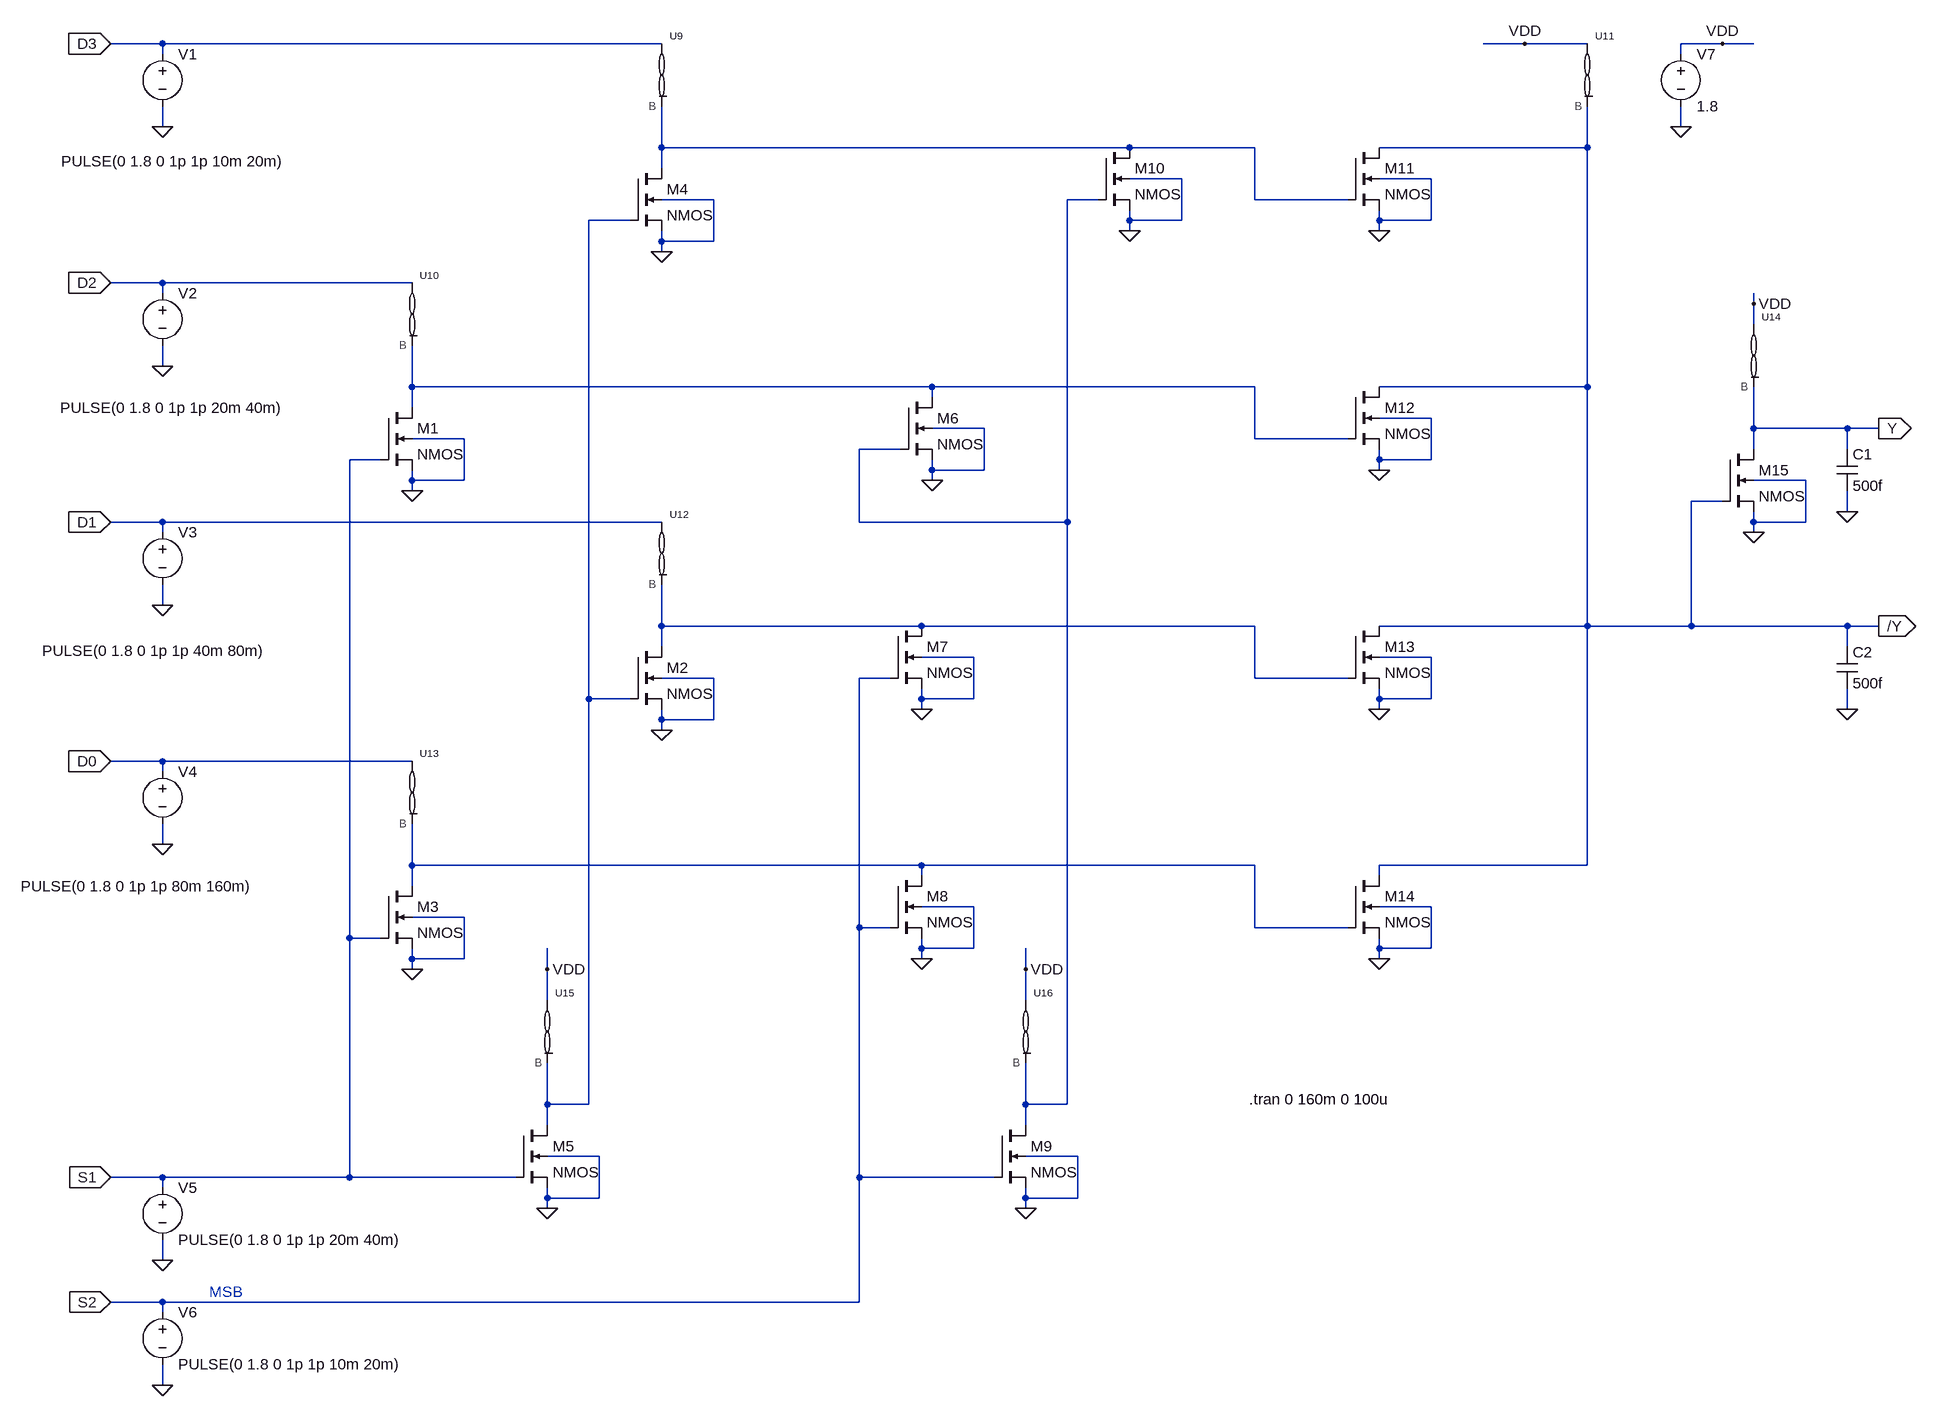
[diagram p0: schematic MUX4to1.asc]
MUX4to1.asc, the LTspice schematic file:
Version 4
SHEET 1 2456 1752
WIRE -272 -352 -352 -352
WIRE 496 -352 -272 -352
WIRE 1824 -352 1760 -352
WIRE 1920 -352 1824 -352
WIRE 2128 -352 2064 -352
WIRE 2176 -352 2128 -352
WIRE -272 -336 -272 -352
WIRE 2064 -336 2064 -352
WIRE -272 -224 -272 -256
WIRE 2064 -224 2064 -256
WIRE 496 -192 496 -256
WIRE 1216 -192 496 -192
WIRE 1408 -192 1216 -192
WIRE 1920 -192 1920 -256
WIRE 1920 -192 1600 -192
WIRE 496 -160 496 -192
WIRE 1296 -144 1216 -144
WIRE 1680 -144 1600 -144
WIRE 576 -112 496 -112
WIRE 1168 -112 1120 -112
WIRE 1408 -112 1408 -192
WIRE 1552 -112 1408 -112
WIRE 448 -80 384 -80
WIRE 1216 -80 1216 -96
WIRE 1296 -80 1296 -144
WIRE 1296 -80 1216 -80
WIRE 1600 -80 1600 -96
WIRE 1680 -80 1680 -144
WIRE 1680 -80 1600 -80
WIRE 1216 -64 1216 -80
WIRE 1600 -64 1600 -80
WIRE 496 -48 496 -64
WIRE 576 -48 576 -112
WIRE 576 -48 496 -48
WIRE 496 -32 496 -48
WIRE -272 16 -352 16
WIRE 112 16 -272 16
WIRE -272 32 -272 16
WIRE 2176 48 2176 32
WIRE 2176 80 2176 48
WIRE -272 144 -272 112
WIRE 112 176 112 112
WIRE 912 176 112 176
WIRE 1408 176 912 176
WIRE 1920 176 1920 -192
WIRE 1920 176 1600 176
WIRE 912 192 912 176
WIRE 112 208 112 176
WIRE 1680 224 1600 224
WIRE 992 240 912 240
WIRE 2176 240 2176 176
WIRE 2320 240 2176 240
WIRE 2368 240 2320 240
WIRE 192 256 112 256
WIRE 1408 256 1408 176
WIRE 1552 256 1408 256
WIRE 864 272 800 272
WIRE 2176 272 2176 240
WIRE 2320 272 2320 240
WIRE 64 288 16 288
WIRE 1600 288 1600 272
WIRE 1680 288 1680 224
WIRE 1680 288 1600 288
WIRE 912 304 912 288
WIRE 992 304 992 240
WIRE 992 304 912 304
WIRE 1600 304 1600 288
WIRE 112 320 112 304
WIRE 192 320 192 256
WIRE 192 320 112 320
WIRE 912 320 912 304
WIRE 2256 320 2176 320
WIRE 112 336 112 320
WIRE 2128 352 2080 352
WIRE 2320 368 2320 336
WIRE -272 384 -352 384
WIRE 496 384 -272 384
WIRE 800 384 800 272
WIRE 1120 384 1120 -112
WIRE 1120 384 800 384
WIRE 2176 384 2176 368
WIRE 2256 384 2256 320
WIRE 2256 384 2176 384
WIRE -272 400 -272 384
WIRE 2176 400 2176 384
WIRE -272 512 -272 480
WIRE 496 544 496 480
WIRE 896 544 496 544
WIRE 1408 544 896 544
WIRE 1920 544 1920 176
WIRE 1920 544 1600 544
WIRE 2080 544 2080 352
WIRE 2080 544 1920 544
WIRE 2320 544 2080 544
WIRE 2368 544 2320 544
WIRE 496 576 496 544
WIRE 2320 576 2320 544
WIRE 976 592 896 592
WIRE 1680 592 1600 592
WIRE 576 624 496 624
WIRE 848 624 800 624
WIRE 1408 624 1408 544
WIRE 1552 624 1408 624
WIRE 384 656 384 -80
WIRE 448 656 384 656
WIRE 896 656 896 640
WIRE 976 656 976 592
WIRE 976 656 896 656
WIRE 1600 656 1600 640
WIRE 1680 656 1680 592
WIRE 1680 656 1600 656
WIRE 896 672 896 656
WIRE 1600 672 1600 656
WIRE 2320 672 2320 640
WIRE 496 688 496 672
WIRE 576 688 576 624
WIRE 576 688 496 688
WIRE 496 704 496 688
WIRE -272 752 -352 752
WIRE 112 752 -272 752
WIRE -272 768 -272 752
WIRE -272 880 -272 848
WIRE 112 912 112 848
WIRE 896 912 112 912
WIRE 1408 912 896 912
WIRE 1920 912 1920 544
WIRE 1920 912 1600 912
WIRE 896 928 896 912
WIRE 1600 928 1600 912
WIRE 112 944 112 912
WIRE 976 976 896 976
WIRE 1680 976 1600 976
WIRE 192 992 112 992
WIRE 800 1008 800 624
WIRE 848 1008 800 1008
WIRE 1408 1008 1408 912
WIRE 1552 1008 1408 1008
WIRE 16 1024 16 288
WIRE 64 1024 16 1024
WIRE 896 1040 896 1024
WIRE 976 1040 976 976
WIRE 976 1040 896 1040
WIRE 1600 1040 1600 1024
WIRE 1680 1040 1680 976
WIRE 1680 1040 1600 1040
WIRE 112 1056 112 1040
WIRE 192 1056 192 992
WIRE 192 1056 112 1056
WIRE 896 1056 896 1040
WIRE 1600 1056 1600 1040
WIRE 112 1072 112 1056
WIRE 320 1072 320 1040
WIRE 1056 1072 1056 1040
WIRE 320 1120 320 1072
WIRE 1056 1120 1056 1072
WIRE 320 1280 320 1216
WIRE 384 1280 384 656
WIRE 384 1280 320 1280
WIRE 1056 1280 1056 1216
WIRE 1120 1280 1120 384
WIRE 1120 1280 1056 1280
WIRE 320 1312 320 1280
WIRE 1056 1312 1056 1280
WIRE 400 1360 320 1360
WIRE 1136 1360 1056 1360
WIRE -272 1392 -352 1392
WIRE 16 1392 16 1024
WIRE 16 1392 -272 1392
WIRE 272 1392 16 1392
WIRE 800 1392 800 1008
WIRE 1008 1392 800 1392
WIRE -272 1408 -272 1392
WIRE 320 1424 320 1408
WIRE 400 1424 400 1360
WIRE 400 1424 320 1424
WIRE 1056 1424 1056 1408
WIRE 1136 1424 1136 1360
WIRE 1136 1424 1056 1424
WIRE 320 1440 320 1424
WIRE 1056 1440 1056 1424
WIRE -272 1520 -272 1488
WIRE -272 1584 -352 1584
WIRE 800 1584 800 1392
WIRE 800 1584 -272 1584
WIRE -272 1600 -272 1584
WIRE -272 1712 -272 1680
FLAG 112 336 0
FLAG 496 704 0
FLAG 112 1072 0
FLAG 496 -32 0
FLAG 320 1440 0
FLAG -352 -352 D3
IOPIN -352 -352 In
FLAG -352 16 D2
IOPIN -352 16 In
FLAG -352 384 D1
IOPIN -352 384 In
FLAG -352 752 D0
IOPIN -352 752 In
FLAG -272 -224 0
FLAG -272 144 0
FLAG -272 512 0
FLAG -272 880 0
FLAG 320 1072 VDD
FLAG 912 320 0
FLAG 896 672 0
FLAG 896 1056 0
FLAG 1056 1440 0
FLAG 1056 1072 VDD
FLAG -352 1392 S1
IOPIN -352 1392 In
FLAG -352 1584 S2
IOPIN -352 1584 In
FLAG -272 1520 0
FLAG -272 1712 0
FLAG 1216 -64 0
FLAG 1600 -64 0
FLAG 1600 304 0
FLAG 1600 672 0
FLAG 1600 1056 0
FLAG 1824 -352 VDD
FLAG 2176 400 0
FLAG 2176 48 VDD
FLAG 2368 240 Y
IOPIN 2368 240 Out
FLAG 2368 544 /Y
IOPIN 2368 544 Out
FLAG 2064 -224 0
FLAG 2128 -352 VDD
FLAG 2320 368 0
FLAG 2320 672 0
SYMBOL nmos4 64 208 R0
SYMATTR InstName M1
SYMATTR Value2 l=0.01u w=40u
SYMBOL nmos4 448 576 R0
SYMATTR InstName M2
SYMATTR Value2 l=0.01u w=40u
SYMBOL nmos4 64 944 R0
SYMATTR InstName M3
SYMATTR Value2 l=0.01u w=40u
SYMBOL nmos4 448 -160 R0
SYMATTR InstName M4
SYMATTR Value2 l=0.01u w=40u
SYMBOL nmos4 272 1312 R0
SYMATTR InstName M5
SYMATTR Value2 l=0.01u w=40u
SYMBOL voltage -272 -352 R0
WINDOW 3 -156 181 Left 2
WINDOW 123 0 0 Left 0
WINDOW 39 0 0 Left 0
SYMATTR Value PULSE(0 1.8 0 1p 1p 10m 20m)
SYMATTR InstName V1
SYMBOL voltage -272 16 R0
WINDOW 3 -157 192 Left 2
WINDOW 123 0 0 Left 0
WINDOW 39 0 0 Left 0
SYMATTR Value PULSE(0 1.8 0 1p 1p 20m 40m)
SYMATTR InstName V2
SYMBOL voltage -272 384 R0
WINDOW 3 -185 198 Left 2
WINDOW 123 0 0 Left 0
WINDOW 39 0 0 Left 0
SYMATTR Value PULSE(0 1.8 0 1p 1p 40m 80m)
SYMATTR InstName V3
SYMBOL voltage -272 752 R0
WINDOW 3 -218 192 Left 2
WINDOW 123 0 0 Left 0
WINDOW 39 0 0 Left 0
SYMATTR Value PULSE(0 1.8 0 1p 1p 80m 160m)
SYMATTR InstName V4
SYMBOL nmos4 864 192 R0
SYMATTR InstName M6
SYMATTR Value2 l=0.01u w=40u
SYMBOL nmos4 848 544 R0
SYMATTR InstName M7
SYMATTR Value2 l=0.01u w=40u
SYMBOL nmos4 848 928 R0
SYMATTR InstName M8
SYMATTR Value2 l=0.01u w=40u
SYMBOL nmos4 1008 1312 R0
SYMATTR InstName M9
SYMATTR Value2 l=0.01u w=40u
SYMBOL voltage -272 1392 R0
WINDOW 123 0 0 Left 0
WINDOW 39 0 0 Left 0
SYMATTR InstName V5
SYMATTR Value PULSE(0 1.8 0 1p 1p 20m 40m)
SYMBOL voltage -272 1584 R0
WINDOW 123 0 0 Left 0
WINDOW 39 0 0 Left 0
SYMATTR InstName V6
SYMATTR Value PULSE(0 1.8 0 1p 1p 10m 20m)
SYMBOL nmos4 1168 -192 R0
SYMATTR InstName M10
SYMATTR Value2 l=0.01u w=40u
SYMBOL nmos4 1552 -192 R0
SYMATTR InstName M11
SYMATTR Value2 l=0.01u w=40u
SYMBOL nmos4 1552 176 R0
SYMATTR InstName M12
SYMATTR Value2 l=0.01u w=40u
SYMBOL nmos4 1552 544 R0
SYMATTR InstName M13
SYMATTR Value2 l=0.01u w=40u
SYMBOL nmos4 1552 928 R0
SYMATTR InstName M14
SYMATTR Value2 l=0.01u w=40u
SYMBOL nmos4 2128 272 R0
SYMATTR InstName M15
SYMATTR Value2 l=0.01u w=40u
SYMBOL voltage 2064 -352 R0
WINDOW 123 0 0 Left 0
WINDOW 39 0 0 Left 0
SYMATTR InstName V7
SYMATTR Value 1.8
SYMBOL cap 2304 272 R0
SYMATTR InstName C1
SYMATTR Value 500f
SYMBOL cap 2304 576 R0
SYMATTR InstName C2
SYMATTR Value 500f
SYMBOL memristor 496 -304 R0
SYMATTR InstName U9
SYMBOL memristor 112 64 R0
SYMATTR InstName U10
SYMBOL memristor 1920 -304 R0
SYMATTR InstName U11
SYMBOL memristor 496 432 R0
SYMATTR InstName U12
SYMBOL memristor 112 800 R0
SYMATTR InstName U13
SYMBOL memristor 2176 128 R0
SYMATTR InstName U14
SYMBOL memristor 320 1168 R0
SYMATTR InstName U15
SYMBOL memristor 1056 1168 R0
SYMATTR InstName U16
TEXT 1400 1272 Left 2 !.tran 0 160m 0 100u
TEXT -200 1568 Left 2 ;MSB

The netlist it stands for:
* MUX4to1.asc
M1 N004 S1 0 0 NMOS l=0.01u w=40u
M2 N005 N003 0 0 NMOS l=0.01u w=40u
M3 N006 S1 0 0 NMOS l=0.01u w=40u
M4 N001 N003 0 0 NMOS l=0.01u w=40u
M5 N003 S1 0 0 NMOS l=0.01u w=40u
V1 D3 0 PULSE(0 1.8 0 1p 1p 10m 20m)
V2 D2 0 PULSE(0 1.8 0 1p 1p 20m 40m)
V3 D1 0 PULSE(0 1.8 0 1p 1p 40m 80m)
V4 D0 0 PULSE(0 1.8 0 1p 1p 80m 160m)
M6 N004 N002 0 0 NMOS l=0.01u w=40u
M7 N005 S2 0 0 NMOS l=0.01u w=40u
M8 N006 S2 0 0 NMOS l=0.01u w=40u
M9 N002 S2 0 0 NMOS l=0.01u w=40u
V5 S1 0 PULSE(0 1.8 0 1p 1p 20m 40m)
V6 S2 0 PULSE(0 1.8 0 1p 1p 10m 20m)
M10 N001 N002 0 0 NMOS l=0.01u w=40u
M11 /Y N001 0 0 NMOS l=0.01u w=40u
M12 /Y N004 0 0 NMOS l=0.01u w=40u
M13 /Y N005 0 0 NMOS l=0.01u w=40u
M14 /Y N006 0 0 NMOS l=0.01u w=40u
M15 Y /Y 0 0 NMOS l=0.01u w=40u
V7 VDD 0 1.8
C1 Y 0 500f
C2 /Y 0 500f
XU9 N001 memristor  ; pins B
XU10 N004 memristor  ; pins B
XU11 /Y memristor  ; pins B
XU12 N005 memristor  ; pins B
XU13 N006 memristor  ; pins B
XU14 Y memristor  ; pins B
XU15 N003 memristor  ; pins B
XU16 N002 memristor  ; pins B
.model NMOS NMOS
.model PMOS PMOS
.lib standard.mos
.tran 0 160m 0 100u
* MSB
.lib memristor.sub
.backanno
.end